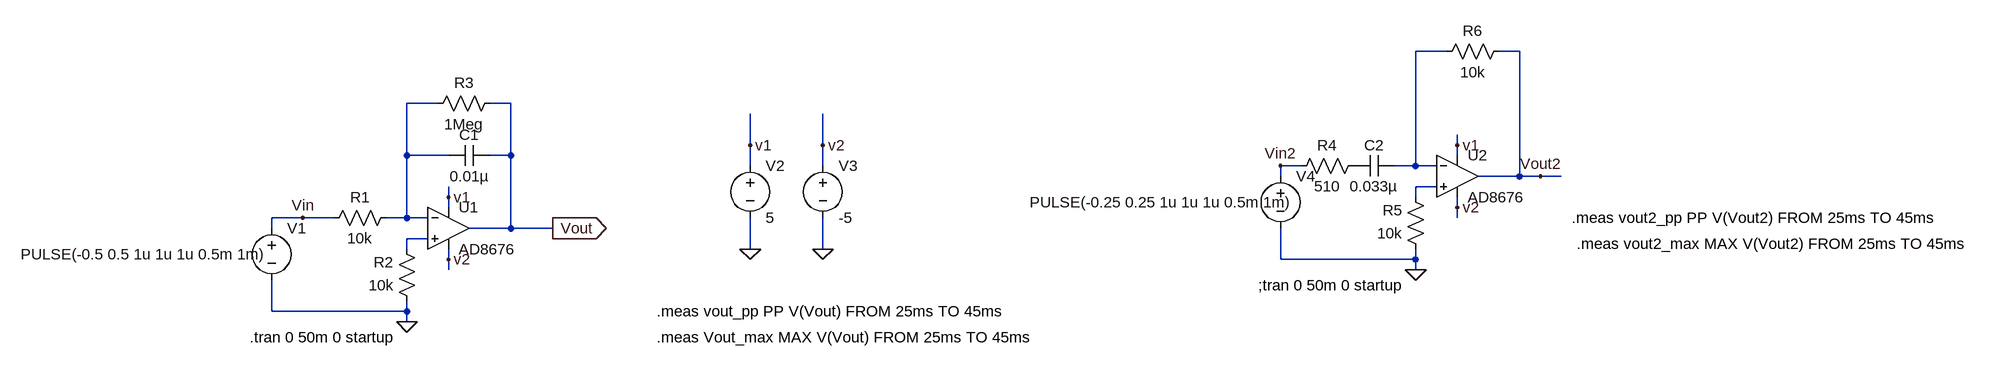
[diagram p0: schematic 1_2.asc]
1_2.asc, the LTspice schematic file:
Version 4
SHEET 1 2576 680
WIRE 1744 -128 1696 -128
WIRE 1856 -128 1824 -128
WIRE 192 -48 144 -48
WIRE 304 -48 272 -48
WIRE 672 16 672 -32
WIRE 784 16 784 -32
WIRE 1760 16 1760 0
WIRE 144 32 144 -48
WIRE 208 32 144 32
WIRE 304 32 304 -48
WIRE 304 32 272 32
WIRE 1760 32 1760 16
WIRE 672 48 672 16
WIRE 784 48 784 16
WIRE 1520 48 1488 48
WIRE 1696 48 1696 -128
WIRE 1696 48 1664 48
WIRE 1728 48 1696 48
WIRE 1488 64 1488 48
WIRE 1856 64 1856 -128
WIRE 1856 64 1792 64
WIRE 1888 64 1856 64
WIRE 1920 64 1888 64
WIRE 1728 80 1696 80
WIRE 208 96 208 80
WIRE 1696 96 1696 80
WIRE 208 112 208 96
WIRE 1760 112 1760 96
WIRE -16 128 -64 128
WIRE 32 128 -16 128
WIRE 144 128 144 32
WIRE 144 128 112 128
WIRE 176 128 144 128
WIRE 1760 128 1760 112
WIRE -64 144 -64 128
WIRE 304 144 304 32
WIRE 304 144 240 144
WIRE 368 144 304 144
WIRE 176 160 144 160
WIRE 144 176 144 160
WIRE 672 176 672 128
WIRE 784 176 784 128
WIRE 208 192 208 176
WIRE 1488 192 1488 144
WIRE 1696 192 1696 176
WIRE 1696 192 1488 192
WIRE 208 208 208 192
WIRE 1696 208 1696 192
WIRE -64 272 -64 224
WIRE 144 272 144 256
WIRE 144 272 -64 272
WIRE 144 288 144 272
FLAG 144 288 0
FLAG 368 144 Vout
IOPIN 368 144 Out
FLAG -16 128 Vin
FLAG 672 176 0
FLAG 784 176 0
FLAG 672 16 v1
FLAG 784 16 v2
FLAG 208 96 v1
FLAG 208 192 v2
FLAG 1696 208 0
FLAG 1760 16 v1
FLAG 1760 112 v2
FLAG 1888 64 Vout2
FLAG 1488 48 Vin2
SYMBOL OpAmps\\AD8676 208 80 R0
SYMATTR InstName U1
SYMBOL res 128 112 R90
WINDOW 0 0 56 VBottom 2
WINDOW 3 32 56 VTop 2
SYMATTR InstName R1
SYMATTR Value 10k
SYMBOL res 160 272 R180
WINDOW 0 36 76 Left 2
WINDOW 3 36 40 Left 2
SYMATTR InstName R2
SYMATTR Value 10k
SYMBOL res 176 -32 R270
WINDOW 0 32 56 VTop 2
WINDOW 3 0 56 VBottom 2
SYMATTR InstName R3
SYMATTR Value 1Meg
SYMBOL cap 272 16 R90
WINDOW 0 0 32 VBottom 2
WINDOW 3 32 32 VTop 2
SYMATTR InstName C1
SYMATTR Value 0.01µ
SYMBOL voltage -64 128 R0
WINDOW 3 -386 56 Left 2
WINDOW 123 0 0 Left 0
WINDOW 39 0 0 Left 0
SYMATTR InstName V1
SYMATTR Value PULSE(-0.5 0.5 1u 1u 1u 0.5m 1m)
SYMBOL voltage 672 32 R0
WINDOW 123 0 0 Left 0
WINDOW 39 0 0 Left 0
SYMATTR InstName V2
SYMATTR Value 5
SYMBOL voltage 784 32 R0
WINDOW 123 0 0 Left 0
WINDOW 39 0 0 Left 0
SYMATTR InstName V3
SYMATTR Value -5
SYMBOL OpAmps\\AD8676 1760 0 R0
SYMATTR InstName U2
SYMBOL res 1712 192 R180
WINDOW 0 36 76 Left 2
WINDOW 3 36 40 Left 2
SYMATTR InstName R5
SYMATTR Value 10k
SYMBOL res 1728 -112 R270
WINDOW 0 32 56 VTop 2
WINDOW 3 0 56 VBottom 2
SYMATTR InstName R6
SYMATTR Value 10k
SYMBOL voltage 1488 48 R0
WINDOW 3 -386 56 Left 2
WINDOW 123 0 0 Left 0
WINDOW 39 0 0 Left 0
SYMATTR InstName V4
SYMATTR Value PULSE(-0.25 0.25 1u 1u 1u 0.5m 1m)
SYMBOL cap 1664 32 R90
WINDOW 0 0 32 VBottom 2
WINDOW 3 32 32 VTop 2
SYMATTR InstName C2
SYMATTR Value 0.033µ
SYMBOL res 1616 32 R90
WINDOW 0 0 56 VBottom 2
WINDOW 3 32 56 VTop 2
SYMATTR InstName R4
SYMATTR Value 510
TEXT -98 312 Left 2 !.tran 0 50m 0 startup
TEXT 528 272 Left 2 !.meas vout_pp PP V(Vout) FROM 25ms TO 45ms
TEXT 528 312 Left 2 !.meas Vout_max MAX V(Vout) FROM 25ms TO 45ms
TEXT 1454 232 Left 2 !;tran 0 50m 0 startup
TEXT 1936 128 Left 2 !.meas vout2_pp PP V(Vout2) FROM 25ms TO 45ms
TEXT 1944 168 Left 2 !.meas vout2_max MAX V(Vout2) FROM 25ms TO 45ms

The netlist it stands for:
* 1_2.asc
XU1 N004 N002 v1 v2 Vout AD8676  ; pins In+ In- V+ V- OUT
R1 N002 Vin 10k
R2 0 N004 10k
R3 N002 Vout 1Meg
C1 Vout N002 0.01µ
V1 Vin 0 PULSE(-0.5 0.5 1u 1u 1u 0.5m 1m)
V2 v1 0 5
V3 v2 0 -5
XU2 N003 N001 v1 v2 Vout2 AD8676  ; pins In+ In- V+ V- OUT
R5 0 N003 10k
R6 N001 Vout2 10k
V4 Vin2 0 PULSE(-0.25 0.25 1u 1u 1u 0.5m 1m)
C2 N001 P001 0.033µ
R4 P001 Vin2 510
.tran 0 50m 0 startup
.meas vout_pp PP V(Vout) FROM 25ms TO 45ms
.meas Vout_max MAX V(Vout) FROM 25ms TO 45ms
;tran 0 50m 0 startup
.meas vout2_pp PP V(Vout2) FROM 25ms TO 45ms
.meas vout2_max MAX V(Vout2) FROM 25ms TO 45ms
.backanno
.end

* Results of the author's LTspice run, read from the files saved beside the schematic
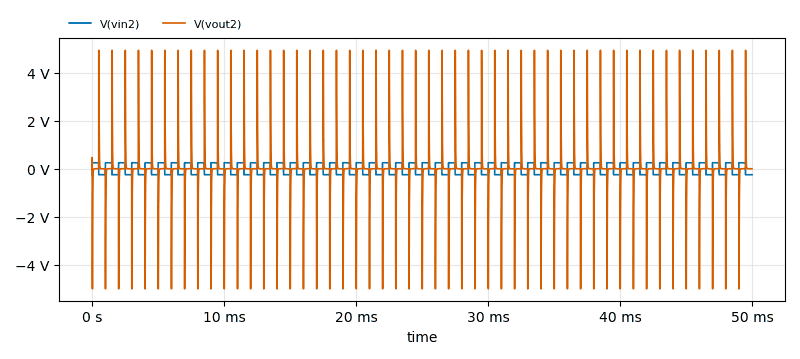
[diagram p1: Transient Analysis of 1_2.asc, plotted from the saved traces]
* Transient Analysis, 1 run:
*   V(vin2): min -250 mV, max 250 mV, average 500 µV, rms 249.9 mV, last -250 mV
*   V(vout2): min -5.01 V, max 4.94 V, average 146.6 µV, rms 1.098 V, last -8.001 µV
* From the log:
*   vout_pp: PP(v(vout))=2.54051 FROM 0.025 TO 0.045
*   vout_max: MAX(v(vout))=1.13945 FROM 0.025 TO 0.045
*   vout2_pp: PP(v(vout2))=9.9499 FROM 0.025 TO 0.045
*   vout2_max: MAX(v(vout2))=4.94 FROM 0.025 TO 0.045